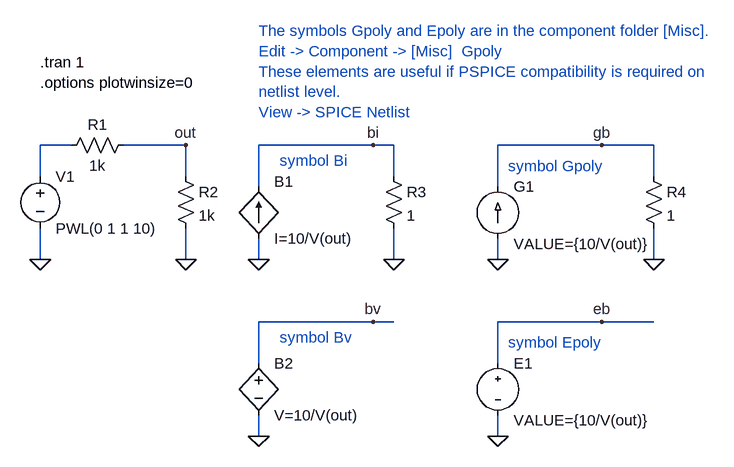
[diagram p0: schematic BehavioralSources.asc]
BehavioralSources.asc, the LTspice schematic file:
Version 4
SHEET 1 880 680
WIRE -400 192 -448 192
WIRE -224 192 -320 192
WIRE 64 192 -112 192
WIRE 96 192 64 192
WIRE 416 192 256 192
WIRE 496 192 416 192
WIRE -448 240 -448 192
WIRE -224 240 -224 192
WIRE 96 240 96 192
WIRE 496 240 496 192
WIRE -112 256 -112 192
WIRE 256 256 256 192
WIRE -448 368 -448 320
WIRE -224 368 -224 320
WIRE -112 368 -112 336
WIRE 96 368 96 320
WIRE 256 368 256 336
WIRE 496 368 496 320
WIRE 64 464 -112 464
WIRE 96 464 64 464
WIRE 416 464 256 464
WIRE 496 464 416 464
WIRE -112 528 -112 464
WIRE 256 528 256 464
WIRE -112 640 -112 608
WIRE 256 640 256 608
FLAG -224 368 0
FLAG -112 368 0
FLAG 256 368 0
FLAG 496 368 0
FLAG 96 368 0
FLAG 64 192 bi
FLAG 416 192 gb
FLAG -448 368 0
FLAG -224 192 out
FLAG -112 640 0
FLAG 256 640 0
FLAG 64 464 bv
FLAG 416 464 eb
SYMBOL bi -112 336 M180
WINDOW 0 24 88 Left 0
WINDOW 3 24 0 Left 0
SYMATTR InstName B1
SYMATTR Value I=10/V(out)
SYMBOL Misc\\Gpoly 256 240 R0
SYMATTR InstName G1
SYMATTR Value VALUE={10/V(out)}
SYMBOL voltage -448 224 R0
WINDOW 123 0 0 Left 0
WINDOW 39 0 0 Left 0
SYMATTR InstName V1
SYMATTR Value PWL(0 1 1 10)
SYMBOL res -416 208 R270
WINDOW 0 32 56 VTop 0
WINDOW 3 0 56 VBottom 0
SYMATTR InstName R1
SYMATTR Value 1k
SYMBOL res -240 224 R0
SYMATTR InstName R2
SYMATTR Value 1k
SYMBOL res 80 224 R0
SYMATTR InstName R3
SYMATTR Value 1
SYMBOL res 480 224 R0
SYMATTR InstName R4
SYMATTR Value 1
SYMBOL bv -112 512 R0
SYMATTR InstName B2
SYMATTR Value V=10/V(out)
SYMBOL Misc\\Epoly 256 512 R0
SYMATTR InstName E1
SYMATTR Value VALUE={10/V(out)}
TEXT -448 64 Left 0 !.tran 1
TEXT -448 96 Left 0 !.options plotwinsize=0
TEXT 272 224 Left 0 ;symbol Gpoly
TEXT -80 216 Left 0 ;symbol Bi
TEXT -112 16 Left 0 ;The symbols Gpoly and Epoly are in the component folder [Misc].\nEdit -> Component -> [Misc]  Gpoly\nThese elements are useful if PSPICE compatibility is required on\nnetlist level.\nView -> SPICE Netlist
TEXT 272 496 Left 0 ;symbol Epoly
TEXT -80 488 Left 0 ;symbol Bv

The netlist it stands for:
* BehavioralSources.asc
B1 0 bi I=10/V(out)
G1 0 gb VALUE={10/V(out)}
V1 N001 0 PWL(0 1 1 10)
R1 N001 out 1k
R2 out 0 1k
R3 bi 0 1
R4 gb 0 1
B2 bv 0 V=10/V(out)
E1 eb 0 VALUE={10/V(out)}
.tran 1
.options plotwinsize=0
* symbol Gpoly
* symbol Bi
* The symbols Gpoly and Epoly are in the component folder [Misc].
* Edit -> Component -> [Misc]  Gpoly
* These elements are useful if PSPICE compatibility is required on
* netlist level.
* View -> SPICE Netlist
* symbol Epoly
* symbol Bv
.backanno
.end